# EAGLE design ESP32_radio_rev1.0 (EAGLE 6.6.0)
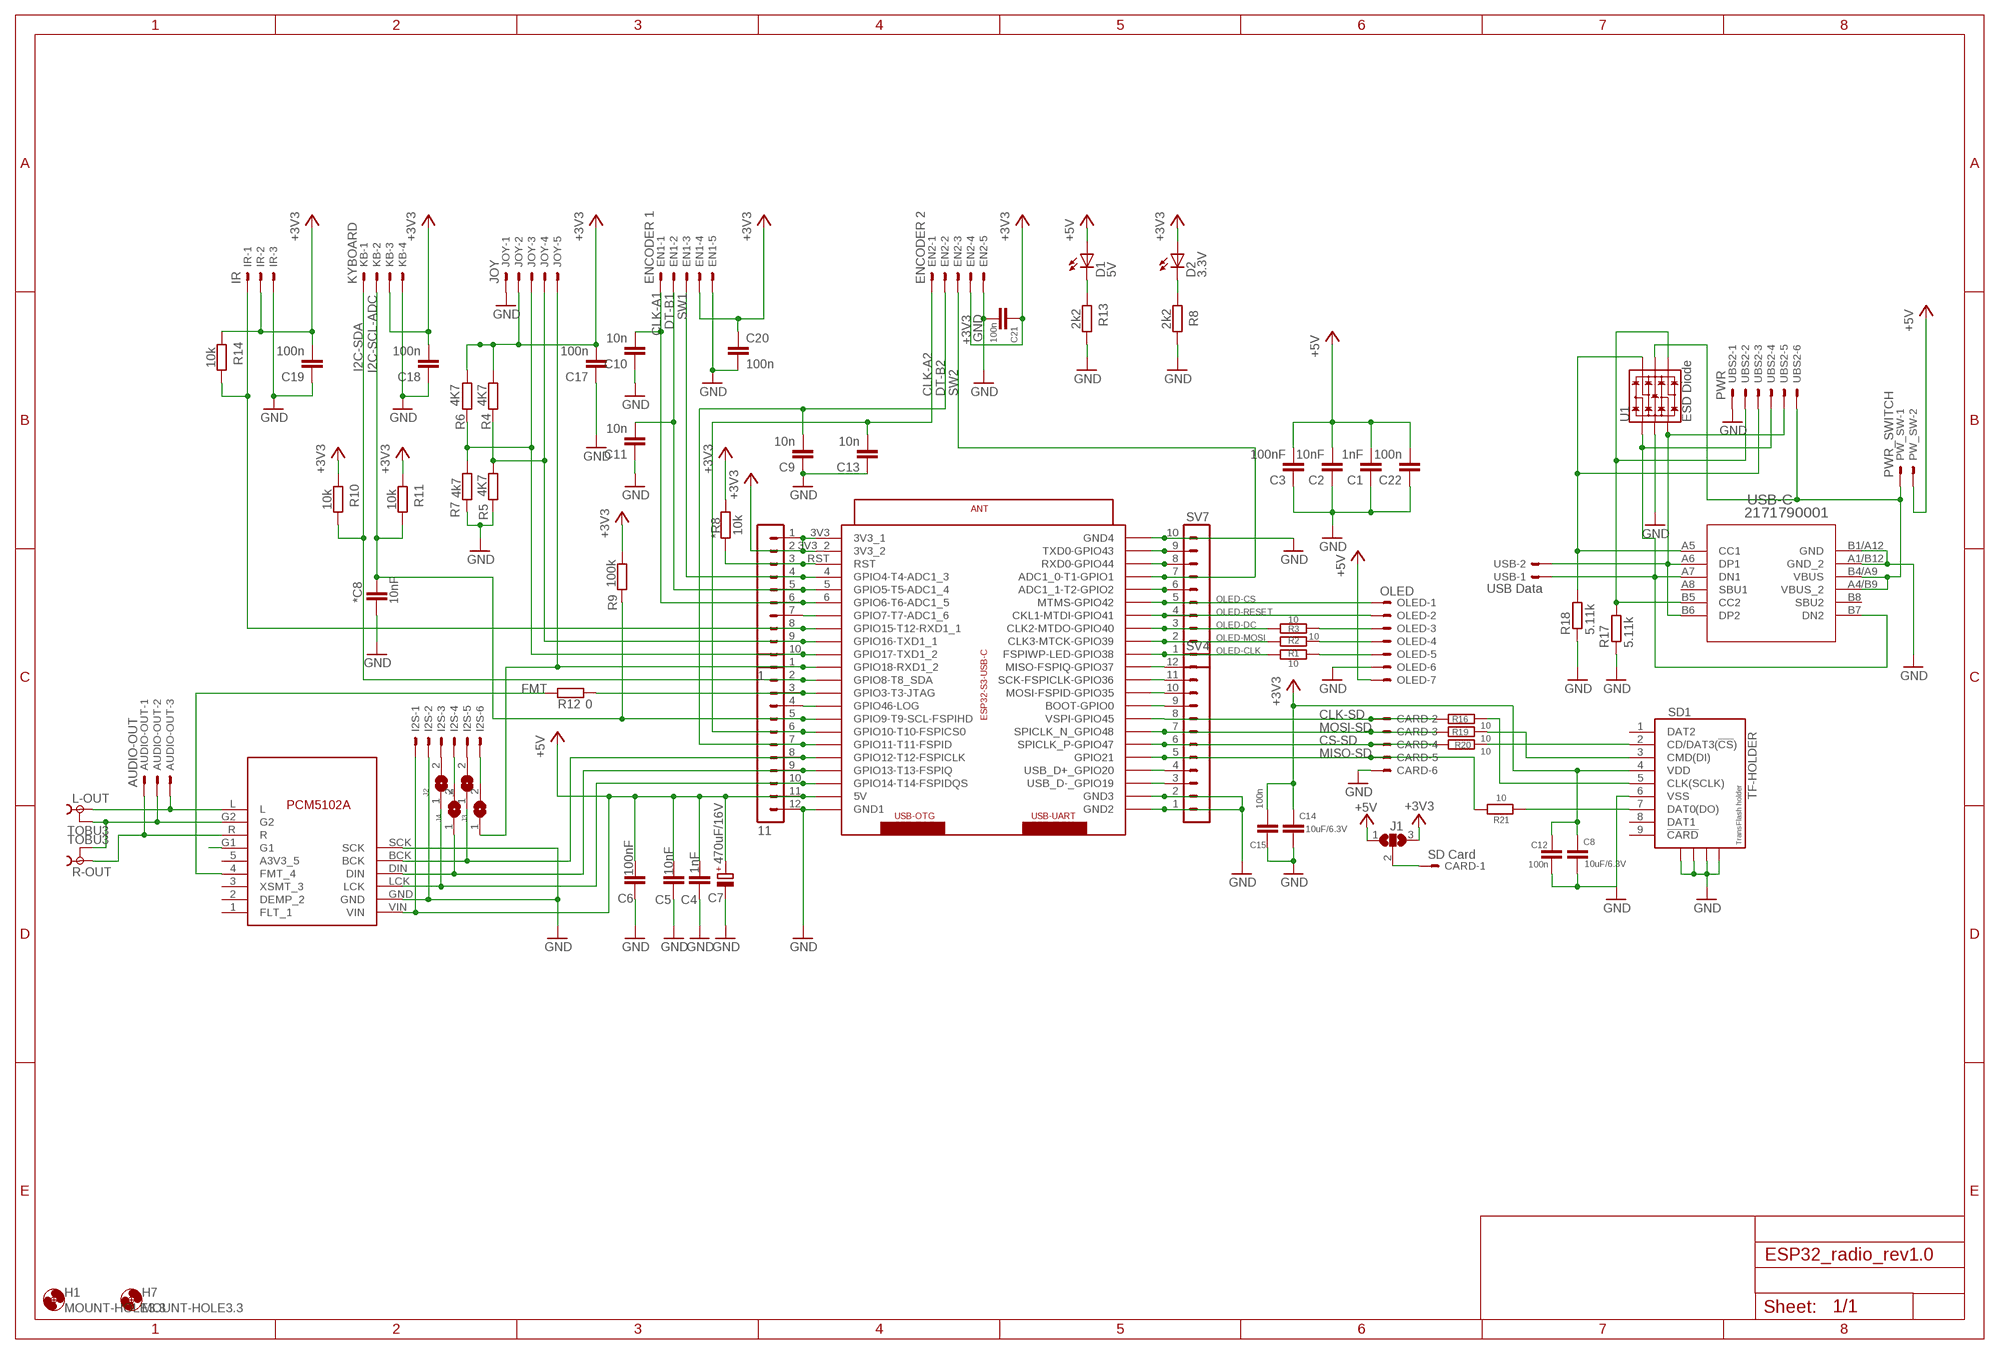
[diagram p0: schematic, sheet 1]

## Parts
1  MA10-1  [MA10-1]
11  MA12-1  [MA12-1]
*C8  10nF  C-EUC0603  [C0603]
*R8  10k  R-EU_R0603  [R0603]
AUDIO-OUT  AUDIO-OUT  JST-XH-03-PIN-LONG-PAD  [JST-XH-03-PACKAGE-LONG-PAD]
C1  1nF  C-EUC0603  [C0603]
C2  10nF  C-EUC0603  [C0603]
C3  100nF  C-EUC0603  [C0603]
C4  1nF  C-EUC0603  [C0603]
C5  10nF  C-EUC0603  [C0603]
C6  100nF  C-EUC0603  [C0603]
C7  470uF/16V  CPOL-EU150CLZ-1010  [150CLZ-1010]
C8  10uF/6.3V  C-EUC1210  [C1210]
C9  10n  C-EUC0603  [C0603]
C10  10n  C-EUC0603  [C0603]
C11  10n  C-EUC0603  [C0603]
C12  100n  C-EUC0603  [C0603]
C13  10n  C-EUC0603  [C0603]
C14  10uF/6.3V  C-EUC1210  [C1210]
C15  100n  C-EUC0603  [C0603]
C17  100n  C-EUC0603  [C0603]
C18  100n  C-EUC0603  [C0603]
C19  100n  C-EUC0603  [C0603]
C20  100n  C-EUC0603  [C0603]
C21  100n  C-EUC0603  [C0603]
C22  100n  C-EUC0603  [C0603]
CARD  SD Card  JST-XH-06-PIN-LONG-PAD  [JST-XH-06-PACKAGE-LONG-PAD]
D1  5V  LEDCHIP-LED0805  [CHIP-LED0805]
D2  3.3V  LEDCHIP-LED0805  [CHIP-LED0805]
EN1  ENCODER 1  JST-XH-05-PIN-LONG-PAD  [JST-XH-05-PACKAGE-LONG-PAD]
EN2  ENCODER 2  JST-XH-05-PIN-LONG-PAD  [JST-XH-05-PACKAGE-LONG-PAD]
H1  MOUNT-HOLE3.3  [3,3]
H7  MOUNT-HOLE3.3  [3,3]
I2S  JST-XH-06-PIN-LONG-PAD  [JST-XH-06-PACKAGE-LONG-PAD]
IR  IR  JST-XH-03-PIN-LONG-PAD  [JST-XH-03-PACKAGE-LONG-PAD]
J1  SJ2W  [SJ_2]
J2  SJ  [SJ]
J3  SJ  [SJ]
J4  SJ  [SJ]
J5  SJ  [SJ]
JOY  JOY  JST-XH-05-PIN-LONG-PAD  [JST-XH-05-PACKAGE-LONG-PAD]
KB  KYBOARD  JST-XH-04-PIN-LONG-PAD  [JST-XH-04-PACKAGE-LONG-PAD]
L-OUT  TOBU3  [TOBU3]
M2  I2S_PCM_51XX_SOUNDCARD  [I2S_PCM_5100_SOUNDCARD]
OLED  OLED  JST-XH-07-PIN-LONG-PAD  [JST-XH-07-PACKAGE-LONG-PAD]
PW_SW  PWR_SWITCH  JST-XH-02-PIN-LONG-PAD  [JST-XH-02-PACKAGE-LONG-PAD]
R1  10  R-EU_R0603  [R0603]
R2  10  R-EU_R0603  [R0603]
R3  10  R-EU_R0603  [R0603]
R4  4K7  R-EU_R0603  [R0603]
R5  4K7  R-EU_R0603  [R0603]
R6  4K7  R-EU_R0603  [R0603]
R7  4k7  R-EU_R0603  [R0603]
R8  2k2  R-EU_R0603  [R0603]
R9  100k  R-EU_R0603  [R0603]
R10  10k  R-EU_R0603  [R0603]
R11  10k  R-EU_R0603  [R0603]
R12  0  R-EU_R0603  [R0603]
R13  2k2  R-EU_R0603  [R0603]
R14  10k  R-EU_R0603  [R0603]
R16  10  R-EU_R0603  [R0603]
R17  5.11k  R-EU_R0603  [R0603]
R18  5.11k  R-EU_R0603  [R0603]
R19  10  R-EU_R0603  [R0603]
R20  10  R-EU_R0603  [R0603]
R21  10  R-EU_R0603  [R0603]
R-OUT  TOBU3  [TOBU3]
SD1  TF-HOLDER  [TF-PULL]
SV4  MA12-1  [MA12-1]
SV7  MA10-1  [MA10-1]
U1  ESD Diode  TVS_DIODE_ARRAY_DT1042-04SO-7  [SOT-23-6]
U$1  ESP32-S3-USBC  [ESP32-S3-USBC]
UBS2  PWR  JST-XH-06-PIN-LONG-PAD  [JST-XH-06-PACKAGE-LONG-PAD]
USB  USB Data  JST-XH-02-PIN-LONG-PAD  [JST-XH-02-PACKAGE-LONG-PAD]
USB-C  2171790001  [2171790001_MOL]

## Nets
5V_USB: PW_SW.1 U1.5(VCC) UBS2.6 USB-C.A4/B9(VBUS_2) USB-C.B4/A9(VBUS)
+3V3: 1.1 1.2 *R8.1 C8.1 C12.2 C14.1 C15.2 C17.2 C18.2 C19.2 C20.1 C21.1 D2.A EN1.4 EN2.4 IR.2 J1.3 JOY.2 KB.3 R4.2 R6.2 R9.2 R10.2 R11.2 R14.2 SD1.4(VDD) U$1.3V3(3V3_1) U$1.3V3_2
+5V: 11.11 C1.2 C2.2 C3.2 C4.2 C5.2 C6.2 C7.+ C22.2 D1.A I2S.1 J1.1 M2.VIN OLED.7 PW_SW.2 U$1.5V
ANALOGGND: AUDIO-OUT.2 L-OUT.2 L-OUT.2@1 L-OUT.2@2 M2.G2 R-OUT.2 R-OUT.2@1 R-OUT.2@2
CLK-A1: 1.6 C10.2 EN1.1 U$1.6(GPIO6-T6-ADC1_5)
CLK-A2: 11.6 C13.2 EN2.1 U$1.10(GPIO10-T10-FSPICS0)
CLK-SD: CARD.2 R16.1 SV4.8 U$1.45(VSPI-GPIO45)
CS-SD: CARD.4 R20.1 SV4.6 U$1.47(SPICLK_P-GPIO47)
DT-B1: 1.5 C11.2 EN1.2 U$1.5(GPIO5-T5-ADC1_4)
DT-B2: 11.7 C9.2 EN2.2 U$1.11(GPIO11-T11-FSPID)
FMT: M2.4(FMT_4) R12.2
FMT1: 11.4 U$1.46(GPIO46-LOG)
GND: 11.12 *C8.2 C1.1 C2.1 C3.1 C4.1 C5.1 C6.1 C7.- C8.2 C9.1 C10.1 C11.1 C12.1 C13.1 C14.2 C15.1 C17.1 C18.1 C19.1 C20.2 C21.2 C22.1 CARD.6 EN1.5 EN2.5 I2S.2 IR.3 JOY.1 KB.4 M2.GND M2.SCK OLED.6 R5.1 R7.1 R8.1 R13.1 R17.1 R18.1 SD1.6(VSS) SD1.S1 SD1.S2 SD1.S3 SD1.S4 SV4.1 SV4.2 SV7.10 U1.2(VSS) U$1.GND1 U$1.GND2 U$1.GND3 U$1.GND4 UBS2.1 USB-C.A1/B12(GND_2) USB-C.B1/A12(GND)
I2C-SCL-ADC: 11.5 *C8.1 KB.2 R9.1 R11.1 U$1.9(GPIO9-T9-SCL-FSPIHD)
I2C-SDA: 11.2 KB.1 R10.1 U$1.8(GPIO8-T8_SDA)
MISO-SD: CARD.5 R21.1 SV4.5 U$1.21(GPIO21)
MOSI-SD: CARD.3 R19.1 SV4.7 U$1.48(SPICLK_N_GPIO48)
N$1: AUDIO-OUT.1 M2.R R-OUT.1
N$2: M2.G1
N$3: AUDIO-OUT.3 L-OUT.1 M2.L
N$4: OLED.5 R1.2
N$5: OLED.4 R2.2
N$6: OLED.3 R3.2
N$7: R21.2 SD1.7(DAT0(DO))
N$8: 1.10 JOY.3 R6.1 R7.2 U$1.17(GPIO17-TXD1_2)
N$9: 11.1 J3.1 JOY.5 U$1.18(GPIO18-RXD1_2)
N$10: 11.10 J2.1 M2.LCK U$1.14(GPIO14-T14-FSPIDQS)
N$11: 1.3 *R8.2 U$1.RST
N$12: R20.2 SD1.2(CD/DAT3(!CS!))
N$13: 1.9 JOY.4 R4.1 R5.2 U$1.16(GPIO16-TXD1_1)
N$14: 11.9 J4.1 M2.DIN U$1.13(GPIO13-T13-FSPIQ)
N$15: 11.8 J5.1 M2.BCK U$1.12(GPIO12-T12-FSPICLK)
N$16: 1.7 U$1.7(GPIO7-T7-ADC1_6)
N$17: SV7.6 U$1.2(ADC1_1-T2-GPIO2)
N$18: 1.8 IR.1 R14.1 U$1.15(GPIO15-T12-RXD1_1)
N$19: D2.C R8.2
N$20: SV7.8 U$1.44(RXD0-GPIO44)
N$21: SV7.9 U$1.43(TXD0-GPIO43)
N$22: SV4.3 U$1.19(USB_D-_GPIO19)
N$23: SV4.4 U$1.20(USB_D+_GPIO20)
N$24: SV4.9 U$1.0(BOOT-GPIO0)
N$25: SV4.10 U$1.35(MOSI-FSPID-GPIO35)
N$26: SV4.11 U$1.36(SCK-FSPICLK-GPIO36)
N$27: SV4.12 U$1.37(MISO-FSPIQ-GPIO37)
N$28: 11.3 R12.1 U$1.3(GPIO3-T3-JTAG)
N$30: D1.C R13.2
N$31: CARD.1 J1.2
N$32: R19.2 SD1.3(CMD(DI))
N$33: R16.2 SD1.5(CLK(SCLK))
N$34: U1.3(IO2) UBS2.5 USB-C.A6(DP1) USB-C.B6(DP2) USB.2
N$35: U1.1(IO1) UBS2.4 USB-C.A7(DN1) USB-C.B7(DN2) USB.1
N$36: I2S.3 J2.2
N$37: R17.2 U1.4(IO3) UBS2.2 USB-C.B5(CC2)
N$38: R18.2 U1.6(IO4) UBS2.3 USB-C.A5(CC1)
N$39: I2S.6 J3.2
N$40: I2S.5 J5.2
N$41: I2S.4 J4.2
OLED-CLK: R1.1 SV7.1 U$1.38(FSPIWP-LED-GPIO38)
OLED-CS: OLED.1 SV7.5 U$1.42(MTMS-GPIO42)
OLED-DC: R3.1 SV7.3 U$1.40(CLK2-MTDO-GPIO40)
OLED-MOSI: R2.1 SV7.2 U$1.39(CLK3-MTCK-GPIO39)
OLED-RESET: OLED.2 SV7.4 U$1.41(CKL1-MTDI-GPIO41)
SW1: 1.4 EN1.3 U$1.4(GPIO4-T4-ADC1_3)
SW2: EN2.3 SV7.7 U$1.1(ADC1_0-T1-GPIO1)
Unconnected: M2.1(FLT_1) M2.2(DEMP_2) M2.3(XSMT_3) M2.5(A3V3_5) SD1.1(DAT2) SD1.8(DAT1) SD1.9(!CARD) USB-C.A8(SBU1) USB-C.B8(SBU2)

## Library data of the parts
1 = con-goldpins:MA10-1: PIN HEADER; OC_FARNELL: unknown; OC_NEWARK: unknown
11 SV4 = con-goldpins:MA12-1: PIN HEADER; OC_FARNELL: unknown; OC_NEWARK: unknown
*C8 C1-C6 C8-C15 C17-C22 = rcl:C-EU: CAPACITOR, European symbol
*R8 R1-R14 R16-R21 = rcl:R-EU_: RESISTOR, European symbol
AUDIO-OUT IR = JST XH Connectors v1-0:JST-XH-03-PIN: JST XH Connector 2 Pin Wire to board connector. Pitch: 2,54 mm, (0.100") Number of pins: 3 Created by Rembrandt Electronics www.rembrandtelectronics.com
C7 = rcl:CPOL-EU: POLARIZED CAPACITOR, European symbol
CARD I2S UBS2 = JST XH Connectors v1-0:JST-XH-06-PIN: JST XH Connector 2 Pin Wire to board connector. Pitch: 2,54 mm, (0.100") Number of pins: 6 Created by Rembrandt Electronics www.rembrandtelectronics.com
D1 D2 = led:LED: LED OSRAM: - CHIPLED LG R971, LG N971, LY N971, LG Q971, LY Q971, LO R971, LY R971 LH N974, LH R974 LS Q976, LO Q976, LY Q976 LO Q996 - Hyper CHIPLED LW Q18S LB Q993, LB Q99A, LB R99A - SideLED LS A670, LO A670, LY A670, LG A670, LP A670 LB A673, LV A673, LT A673, LW A673 LH A674 LY A675 LS A676, LA A676, LO A676, LY A676, LW A676 LS A679, LY A679, LG A679 - Hyper Micro SIDELED® LS Y876, LA Y876, LO Y876, LY Y876 LT Y87S - SmartLED LW L88C, LW L88S LB L89C, LB L89S, LG L890 LS L89K, LO L89K, LY L89K LS L896, LA L896, LO L896, LY L896 - TOPLED LS T670, LO T670, LY T670, LG T670, LP T670 LSG T670, LSP T670, LSY T670, LOP T670, LYG T670 LG T671, LOG T671, LSG T671 LB T673, LV T673, LT T673, LW T673 LH T674 LS T676, LA T676, LO T676, LY T676, LB T676, LH T676, LSB T676, LW T676 LB T67C, LV T67C, LT T67C, LS T67K, LO T67K, LY T67K, LW E67C LS E67B, LA E67B, LO E67B, LY E67B, LB E67C, LV E67C, LT E67C LW T67C LS T679, LY T679, LG T679 LS T770, LO T770, LY T770, LG T770, LP T770 LB T773, LV T773, LT T773, LW T773 LH T774 LS E675, LA E675, LY E675, LS T675 LS T776, LA T776, LO T776, LY T776, LB T776 LHGB T686 LT T68C, LB T68C - Hyper Mini TOPLED® LB M676 - Mini TOPLED Santana® LG M470 LS M47K, LO M47K, LY M47K Source: http://www.osram.convergy.de LUXEON: - LUMILED® LXK2-PW12-R00, LXK2-PW12-S00, LXK2-PW14-U00, LXK2-PW14-V00 LXK2-PM12-R00, LXK2-PM12-S00, LXK2-PM14-U00 LXK2-PE12-Q00, LXK2-PE12-R00, LXK2-PE12-S00, LXK2-PE14-T00, LXK2-PE14-U00 LXK2-PB12-K00, LXK2-PB12-L00, LXK2-PB12-M00, LXK2-PB14-N00, LXK2-PB14-P00, LXK2-PB14-Q00 LXK2-PR12-L00, LXK2-PR12-M00, LXK2-PR14-Q00, LXK2-PR14-R00 LXK2-PD12-Q00, LXK2-PD12-R00, LXK2-PD12-S00 LXK2-PH12-R00, LXK2-PH12-S00 LXK2-PL12-P00, LXK2-PL12-Q00, LXK2-PL12-R00 Source: www.luxeon.com KINGBRIGHT: KA-3528ASYC Source: www.kingbright.com
EN1 EN2 JOY = JST XH Connectors v1-0:JST-XH-05-PIN: JST XH Connector 2 Pin Wire to board connector. Pitch: 2,54 mm, (0.100") Number of pins: 5 Created by Rembrandt Electronics www.rembrandtelectronics.com
H1 H7 = holes:MOUNT-HOLE: MOUNTING HOLE with drill center marker
J1 = jumper:SJ2W: SMD solder JUMPER
J2-J5 = jumper:SJ: SMD solder JUMPER
KB = JST XH Connectors v1-0:JST-XH-04-PIN: JST XH Connector 2 Pin Wire to board connector. Pitch: 2,54 mm, (0.100") Number of pins: 4 Created by Rembrandt Electronics www.rembrandtelectronics.com
L-OUT R-OUT = con-hirschmann:TOBU3: Female Cinch CONNECTOR ( RCA Jack ); MF: FARNELL; MPN: TOBU 3; OC_FARNELL: 592791; OC_NEWARK: 06WX5914
M2 = PCM5102A:I2S_PCM_51XX_SOUNDCARD
OLED = JST XH Connectors v1-0:JST-XH-07-PIN: JST XH Connector 2 Pin Wire to board connector. Pitch: 2,54 mm, (0.100") Number of pins: 7 Created by Rembrandt Electronics www.rembrandtelectronics.com
PW_SW USB = JST XH Connectors v1-0:JST-XH-02-PIN: JST XH Connector 2 Pin Wire to board connector. Pitch: 2,54 mm, (0.100") Number of pins: 2 Created by Rembrandt Electronics www.rembrandtelectronics.com
SD1 = sd-mmc:TF-HOLDER: TF / Micro SD socket is PUSH-PUSH type, the card can be pushed into and auto locked and pushed out by simply press the card. Surface Mounting type.
SV7 = con-lstb:MA10-1: PIN HEADER; OC_FARNELL: unknown; OC_NEWARK: unknown
U1 = SparkFun-DiscreteSemi:TVS_DIODE_ARRAY; PROD_ID: IC-13538
U$1 = ESP32:ESP32-S3-USBC: ESP32 S3 WROOM-1; WROOM-1: ESP32
USB-C = USB-C_2:2171790001; COPYRIGHT: Copyright (C) 2025 GRo; MANUFACTURER_PART_NUMBER: USB4105-GF-A-120; MFR_NAME: GFT

## Net classes
0 default: clearance 0.205 mm

## Board
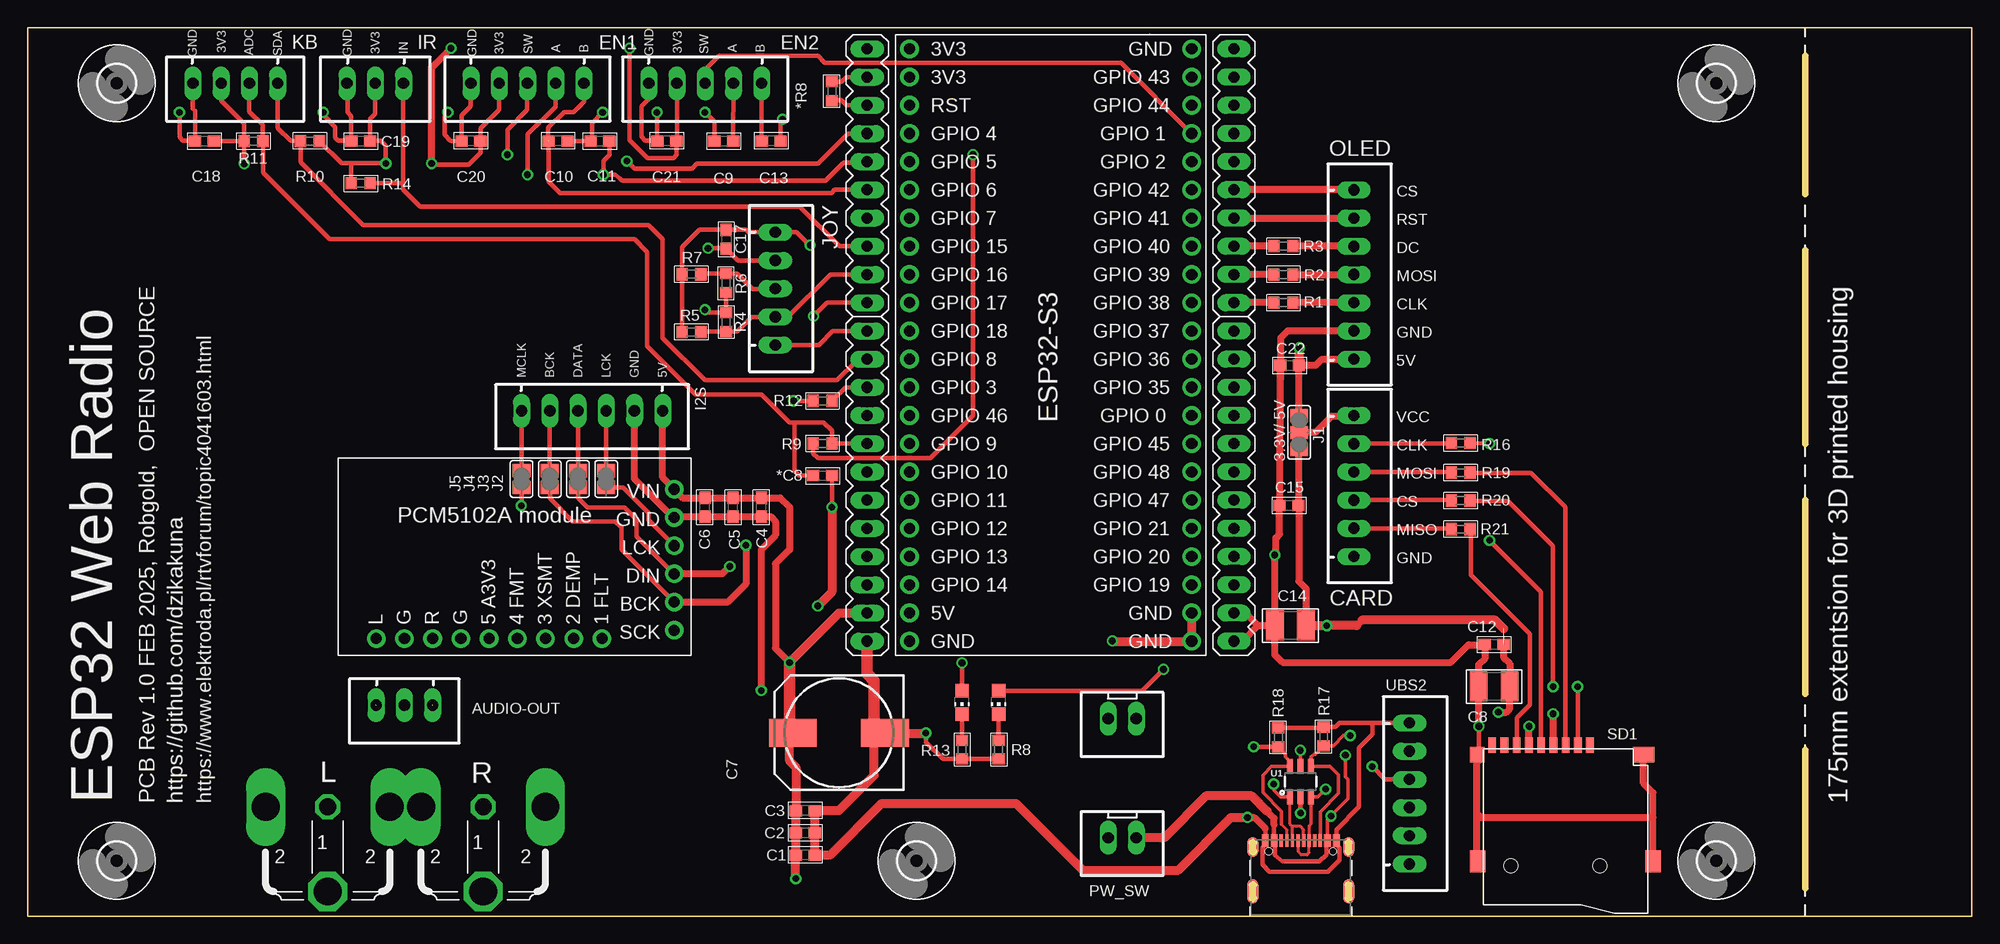
[diagram p1: board, top side]
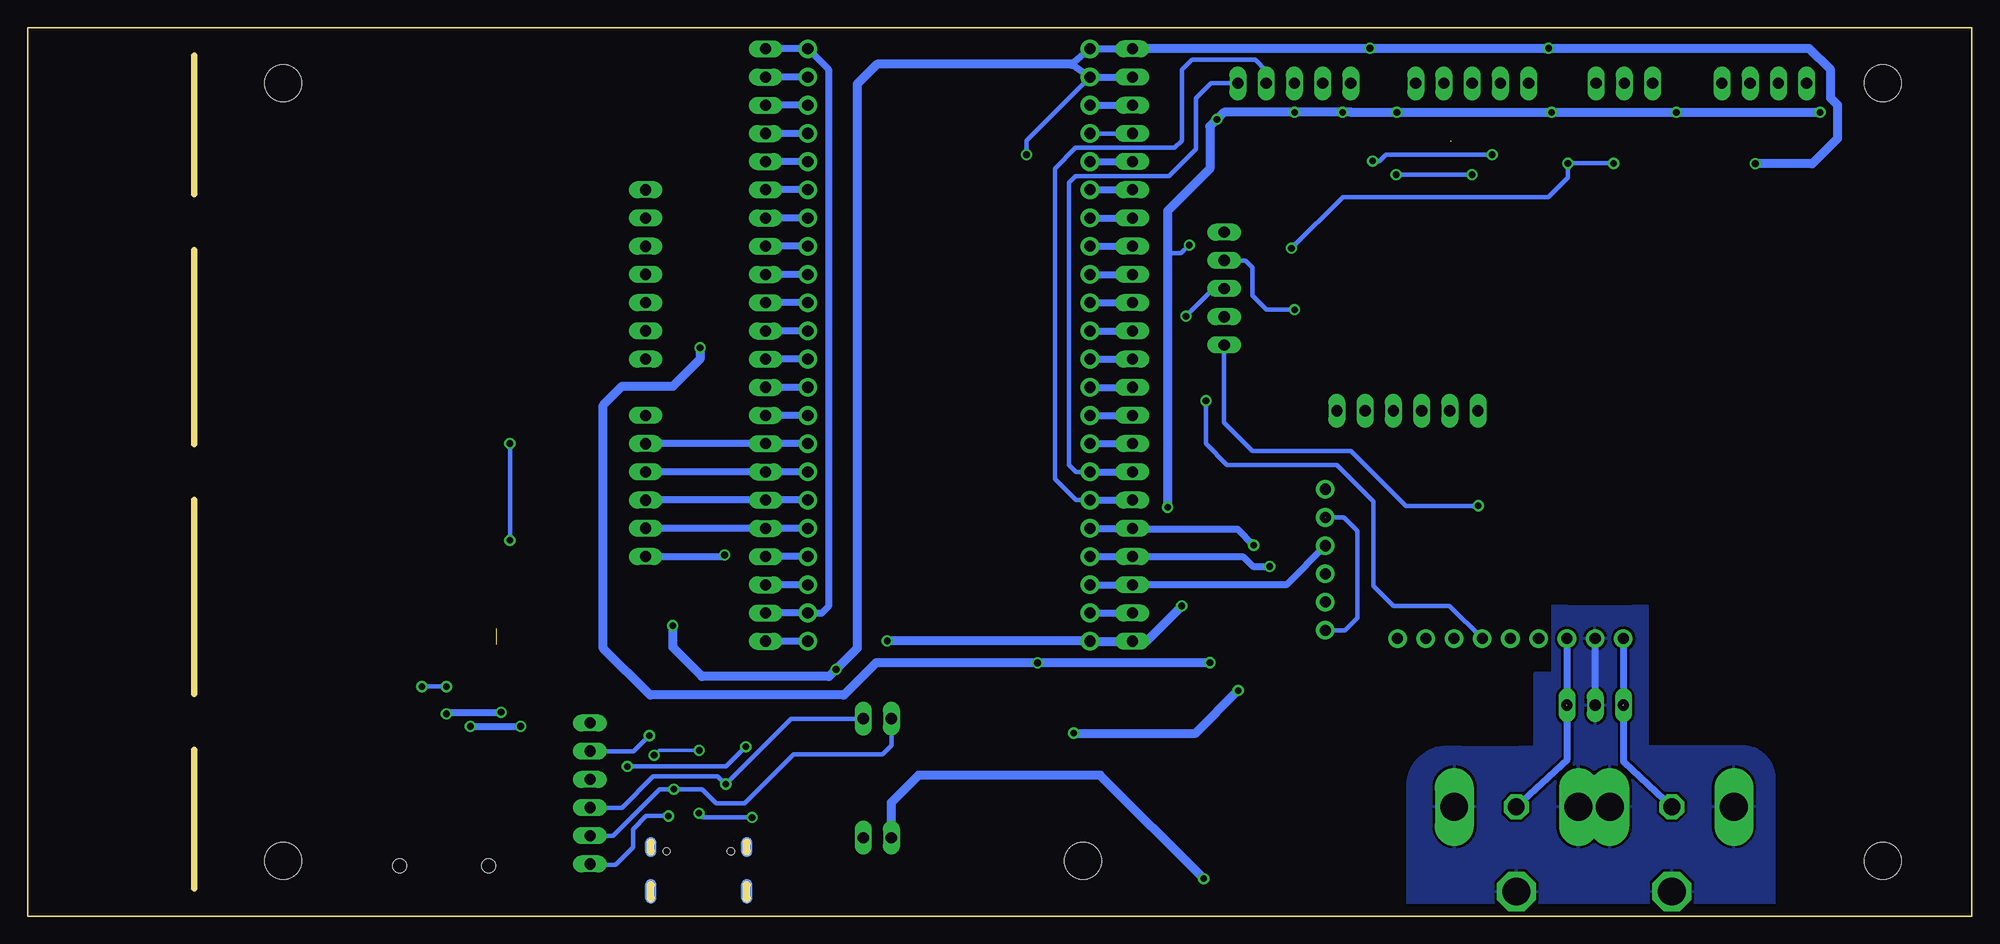
[diagram p2: board, bottom side, seen from below]

Size 175 x 80 mm. Coordinates in mm from the lower left corner, seen from the top.
Outline: 0,0 175,0 175,80 0,80 0,0
Copper layers (1*16): Top 0.035mm / dielectric 1.5mm / Bottom 0.035mm
Design rules "default": minimum track width 10mil, minimum drill 24mil, track to track 8mil, track to pad 8mil, pad to pad 8mil, via to via 8mil, smd to smd 8mil, copper to edge 40mil, drill to drill 8mil, minimum pad ring 10mil, minimum via ring 8mil, stop-mask expansion 4mil, vias tented up to drill 0mil, thermal gap 10mil
tKeepout: area 115.6,76.2 to 135.9,80
bKeepout: area 115.6,76.2 to 135.9,80
Milling: 4 lines

### Footprints (pad centres in the part's own frame; a part is rotated, then mirrored left to right if it is on the bottom)
MA10-1 = drill 1 long: 1 -11.43,0; 2 -8.89,0; 3 -6.35,0; 4 -3.81,0; 5 -1.27,0; 6 1.27,0; 7 3.81,0; 8 6.35,0; 9 8.89,0; 10 11.43,0
MA12-1 = drill 1 long: 1 -13.97,0; 2 -11.43,0; 3 -8.89,0; 4 -6.35,0; 5 -3.81,0; 6 -1.27,0; 7 1.27,0; 8 3.81,0; 9 6.35,0; 10 8.89,0; 11 11.43,0; 12 13.97,0
C0603 = smd 1.1 x 1: 1 -0.85,0; 2 0.85,0
R0603 = smd 1 x 1.1: 1 -0.85,0; 2 0.85,0
JST-XH-03-PACKAGE-LONG-PAD = drill 1.016 long: 1 -2.54,0; 2 0,0; 3 2.54,0
150CLZ-1010 = smd 4.3 x 2.5: + 4.15,0; - -4.15,0
C1210 = smd 1.6 x 2.7: 1 -1.4,0; 2 1.4,0
JST-XH-06-PACKAGE-LONG-PAD = drill 1.016 long: 1 -6.35,0; 2 -3.81,0; 3 -1.27,0; 4 1.27,0; 5 3.81,0; 6 6.35,0
CHIP-LED0805 = smd 1.2 x 1.2: A 0,-1.05; C 0,1.05
JST-XH-05-PACKAGE-LONG-PAD = drill 1.016 long: 1 -5.08,0; 2 -2.54,0; 3 0,0; 4 2.54,0; 5 5.08,0
3,3 = hole 3.3: 0,0
SJ_2 = smd 1.168 x 1.6: 1 -1.524,0; 2 0,0; 3 1.524,0
SJ = smd 1.168 x 1.6: 1 -0.762,0; 2 0.762,0
JST-XH-04-PACKAGE-LONG-PAD = drill 1.016 long: 1 -3.81,0; 2 -1.27,0; 3 1.27,0; 4 3.81,0
TOBU3 = drill 1.5 octagon: 1 0,-2.54 | drill 2.5 pad 3.2 long: 2 5.588,-2.54; 2@1 -5.588,-2.54 | drill 2.5 octagon: 2@2 0,5.08
I2S_PCM_5100_SOUNDCARD = drill 1 pad 1.676: 1 1.5,8; 2 1.5,10.54; 3 1.5,13.08; 4 1.5,15.62; 5 1.5,18.16; BCK 4.79,1.5; DIN 7.33,1.5; G1 1.5,20.7; G2 1.5,25.78; GND 12.41,1.5; L 1.5,28.32; LCK 9.87,1.5; R 1.5,23.24; SCK 2.25,1.5; VIN 14.95,1.5
JST-XH-07-PACKAGE-LONG-PAD = drill 1.016 long: 1 -7.62,0; 2 -5.08,0; 3 -2.54,0; 4 0,0; 5 2.54,0; 6 5.08,0; 7 7.62,0
JST-XH-02-PACKAGE-LONG-PAD = drill 1.016 long: 1 -1.27,0; 2 1.27,0
TF-PULL = smd 0.7 x 1.4: 1 -2.2,-7.62; 2 -1.1,-7.62; 3 0,-7.62; 4 1.1,-7.62; 5 2.2,-7.62; 6 3.3,-7.62; 7 4.4,-7.62; 8 5.5,-7.62; 9 6.6,-7.62 | smd 1.4 x 2: S1 -7.9,2.85; S2 7.9,2.85 | smd 1.28 x 1.4: S3 7.96,-6.75 | smd 1.95 x 1.4: S4 -7.025,-6.75 | hole 1.25: -3.1,3.25; 4.9,3.25
SOT-23-6 = smd 0.55 x 1.35: 1 -0.95,-1.375; 2 0,-1.375; 3 0.95,-1.375; 4 0.95,1.375; 5 0,1.375; 6 -0.95,1.375
ESP32-S3-USBC = drill 1 pad 1.676: 0 12.7,-5.08; 1 12.7,20.32; 2 12.7,17.78; 3 -12.7,-2.54; 3V3 -12.7,27.94; 3V3_2 -12.7,25.4; 4 -12.7,20.32; 5 -12.7,17.78; 5V -12.7,-22.86; 6 -12.7,15.24; 7 -12.7,12.7; 8 -12.7,0; 9 -12.7,-7.62; 10 -12.7,-10.16; 11 -12.7,-12.7; 12 -12.7,-15.24; 13 -12.7,-17.78; 14 -12.7,-20.32; 15 -12.7,10.16; 16 -12.7,7.62; 17 -12.7,5.08; 18 -12.7,2.54; 19 12.7,-20.32; 20 12.7,-17.78; 21 12.7,-15.24; 35 12.7,-2.54; 36 12.7,0; 37 12.7,2.54; 38 12.7,5.08; 39 12.7,7.62; 40 12.7,10.16; 41 12.7,12.7; 42 12.7,15.24; 43 12.7,25.4; 44 12.7,22.86; 45 12.7,-7.62; 46 -12.7,-5.08; 47 12.7,-12.7; 48 12.7,-10.16; GND1 -12.7,-25.4; GND2 12.7,-25.4; GND3 12.7,-22.86; GND4 12.7,27.94; RST -12.7,22.86
2171790001_MOL = smd 0.991 x 1.803 bottom: 1 -4.32,2.728; 5 4.32,2.728 | smd 0.991 x 2.21 bottom: 2 -4.32,-1.272; 3 4.32,-1.272 | smd 0.991 x 1.803: 4 4.32,2.728; 15 -4.32,2.728; 16 4.32,2.728 | smd 0.991 x 2.21: 13 -4.32,-1.272; 14 4.32,-1.272 | smd 0.61 x 1.143: A1/B12 -3.2,3.303; A4/B9 -2.4,3.303; B1/A12 3.2,3.303; B4/A9 2.4,3.303 | smd 0.305 x 1.143: A5 -1.25,3.303; A6 -0.25,3.303; A7 0.25,3.303; A8 1.25,3.303; B5 1.75,3.303; B6 0.75,3.303; B7 -0.75,3.303; B8 -1.75,3.303 | hole 0.6: -4.32,-1.876; -4.32,-0.686; -4.32,3.124; -4.32,2.337; 4.32,3.124; 4.32,2.337; 4.32,-0.686; 4.32,-1.88 | hole 0.65: -2.89,2.337; 2.89,2.337

### Placement (x,y rotation side)
1  75.56,66.67 270 top
11  75.56,38.73 270 top
*C8  71.55,39.67 0 top
*R8  72.39,74.3 270 top
AUDIO-OUT  33.9,19 180 top
C1  70,5.5 180 top
C2  70,7.5 180 top
C3  70,9.5 180 top
C4  66.04,36.83 90 top
C5  63.5,36.83 90 top
C6  60.96,36.83 90 top
C7  73.03,16.51 180 top
C8  132,20.68 180 top
C9  62.66,69.8 0 top
C10  47.74,69.8 180 top
C11  51.51,69.8 0 top
C12  132,24.47 0 top
C13  66.92,69.8 180 top
C14  113.67,26.16 180 top
C15  113.54,37 0 top
C17  62.87,60.96 270 top
C18  15.9,69.8 0 top
C19  29.98,69.8 0 top
C20  39.9,69.8 180 top
C21  57.53,69.8 180 top
C22  113.59,49.61 0 top
CARD  119.38,38.73 270 top
D1  84.1,19.25 180 top
D2  87.4,19.25 180 top
EN1  44.98,75 180 top
EN2  60.98,75 180 top
H1  8,75 0 top
H2  MOUNT-HOLE3.3  [3,3]  152,75 0 top
H3  MOUNT-HOLE3.3  [3,3]  152,5 0 top
H7  8,5 0 top
H8  MOUNT-HOLE3.3  [3,3]  80,5 0 top
I2S  50.8,45.5 180 top
IR  31.28,75 180 top
J1  114.45,43.56 270 top
J2  52.07,39.37 90 top
J3  44.45,39.37 90 top
J4  49.53,39.37 90 top
J5  46.99,39.37 90 top
JOY  67.29,56.51 270 top
KB  18.68,75 180 top
L-OUT  27,7.3 180 top
M2  59.69,23.5 90 top
OLED  119.38,57.78 270 top
PW_SW  98.53,7.06 180 top
R1  113.03,55.24 0 top
R2  113.03,57.78 0 top
R3  113.03,60.33 0 top
R4  62.87,53.49 90 top
R5  59.74,52.6 0 top
R6  62.87,57 270 top
R7  59.74,57.8 0 top
R8  87.4,15 90 top
R9  71.55,42.57 180 top
R10  25.4,69.8 0 top
R11  20.32,69.8 180 top
R12  71.55,46.41 180 top
R13  84.1,15 90 top
R14  29.98,66 180 top
R16  129,42.6 0 top
R17  116.66,16.18 270 top
R18  112.57,16.1 270 top
R19  129,39.93 0 top
R20  129,37.41 0 top
R21  129,34.85 0 top
R-OUT  41,7.3 180 top
SD1  138.43,7.8 180 top
SV4  108.58,38.73 90 top
SV7  108.58,66.67 90 top
U1  114.58,12.12 0 top
U$1  92.08,50.16 0 top
UBS2  124.38,11.05 270 top
USB  98.53,17.78 180 top
USB-C  114.6,3.5 0 top

### Tracks (layer width: path | path; a pad name or v marks a point on that pad's centre or on a via)
5V_USB  (via drill 0.6)
  Top 0.305: U1.5 114.55,13.52 v114.55,14.94 | USB-C.B4/A9 117,8.69 v117.32,9.02 118.85,10.55 118.85,12.32 118.62,12.55 v118.62,14.49
  Top 0.406: 112.19,8.23 USB-C.A4/B9 112.29,6.79 112.29,5.46 112.95,4.93 116.28,4.93 116.89,5.54 116.89,6.69 USB-C.B4/A9
  Top 0.61: 112.19,8.23 112.19,8.81 111.56,9.45 111.56,9.46
  Top 0.813: PW_SW.1 102.31,7.06 106.07,10.82 110.2,10.82 111.56,9.46
  Bottom 0.305: v118.62,14.49 118.18,14.94 v114.55,14.94
  Bottom 0.406: UBS2.6 124.33,4.65 122.07,4.65 120.5,6.22 120.5,7.84 119.32,9.02 v117.32,9.02
+3V3  (via drill 0.6, 0.6 pad 0.81)  (1 unrouted)
  Top 0.406: R9.2 70.71,42.58 70.71,41.68 71.12,41.27 81.28,41.27 85.09,45.09 v85.09,68.58 | 1.2 73.71,75.56 73.28,75.13 72.4,75.13 *R8.1 | R6.2 R4.2 61.23,54.34 v60.96,54.61 | JOY.2 63.92,59.05 C17.2 62.83,60.15 v61.24,60.15 | EN1.4 42.42,74.98 42.42,72.64 40.75,70.98 C20.1 40.75,68.77 39.67,67.69 36.45,67.69 v36.35,67.79 | IR.2 31.29,74.99 31.29,72.26 30.83,71.8 C19.2 30.86,69.77 30.94,69.85 31.75,69.85 32.23,69.37 v32.23,67.79 | 31.55,67.79 v32.23,67.79 | R10.2 28.26,67.79 29.21,67.79 | 29.21,67.79 v32.23,67.79 | C18.2 R11.2 | KB.3 17.41,73.44 19.47,71.38 R11.2 | R14.2 29.13,67.71 29.21,67.79 | EN2.4 58.44,69.86 C21.1 58.42,69.76 58.42,68.58 58.12,68.28 55.78,68.28 54.18,69.88 v54.18,78.16 | v19.48,67.76 v19.47,67.77 R11.2 | D2.A 100.31,20.3 v102.23,22.23
  Top 0.61: 120.14,26.67 119.63,26.16 | v36.35,67.79 36.35,76.41 v38.1,78.16 | C12.2 132.85,23.31 133.4,22.76 C8.1 133.4,18.67 133.1,18.36 v132.38,18.36 | SD1.4 137.33,18.19 v137.31,18.21 | C14.1 115.06,29.51 114.43,30.15 114.43,36.96 C15.2 114.45,37.06 J1.3
  Top 0.813: C14.1 v116.94,26.16 119.63,26.16 | 132.85,25.9 132.08,26.67 120.14,26.67
  Bottom 0.406: v61.24,60.15 56.62,64.77 38.1,64.77 36.35,66.52 v36.35,67.79 v32.23,67.79 | v60.96,54.61 63.5,54.61 64.77,55.88 64.77,58.42 65.4,59.05 JOY.2 | v85.09,68.58 85.09,69.85 U$1.3V3_2
  Bottom 0.61: 1.1 U$1.3V3 81.03,76.71 U$1.3V3_2 1.2 | v137.31,18.21 137.16,18.36 v132.38,18.36
  Bottom 0.813: 81.03,76.71 98.55,76.71 100.33,74.93 100.33,24.13 101.6,22.86 v102.23,22.23 102.87,21.59 114.3,21.59 116.94,24.23 v116.94,26.16 | 1.1 75.51,78.16 v54.18,78.16 v38.1,78.16 14.66,78.16 12.7,76.2 12.7,73.66 12.08,73.04 12.08,70.05 14.37,67.76 v19.48,67.76
+5V  (via drill 0.6)
  Top 0.406: 68.56,22.84 v68.58,22.84 | D1.A v84.1,22.81 arc90 v84.1,22.81
  Top 0.61: 68.58,22.86 67.31,24.13 67.31,31.75 68.58,33.02 68.58,36.83 67.73,37.68 C4.2 C5.2 C6.2 58.95,37.68 M2.VIN 57.15,39.48 I2S.1 | OLED.7 116.51,50.16 115.95,49.61 C22.2 114.44,45.1 J1.1
  Top 0.813: 67.59,16.53 C7.+ | 11.11 73.03,27.3 68.58,22.86 v68.58,22.84 | C7.+ 68.58,16.8 | C7.+ 68.58,16.21 68.58,13.97 69.15,13.4 C3.2 C2.2 C1.2 69.14,5.49 v69.14,3.38 | C22.2 114.48,49.65 v114.48,51.18
  Top 1.016: 68.58,16.8 v68.58,22.84
  Bottom 0.406: v84.1,22.81 83.87,22.81 arc-90 83.82,22.86
  Bottom 0.61: U$1.5V 11.11 | v68.58,22.84 68.61,22.81
  Bottom 0.813: 68.61,22.81 v84.1,22.81 98.63,22.81 101.52,19.91 118.97,19.91 123.19,24.13 123.19,46.02 121.49,47.73 116.92,47.73 114.48,50.16 v114.48,51.18 | PW_SW.2 97.26,10.24 94.8,12.7 78.46,12.7 v69.14,3.38
ANALOGGND
  Bottom 0.61: M2.G2 33.91,19.03 | R-OUT.2 35.35,11.47 33.92,12.45 32.55,11.35 L-OUT.2@1
  pour Bottom (isolate 0.254): 17.78,0 17.78,12.4 arc-90 20.62,15.24 29.21,15.24 29.21,27.94 arc5 37.75,27.94 37.75,21.85 39.37,21.85 39.37,15.24 arc4 47.21,15.24 arc-90 50.8,11.65 50.8,0
CLK-A1  (1 unrouted)
  Top 0.406: 75.51,65.46 1.6 72.64,65.41 72.34,65.1 47.93,65.1 46.9,66.14 C10.2 | EN1.1 50.06,73.33 49.12,72.39 48.26,72.39 46.86,70.99 46.86,69.83
  Bottom 0.61: U$1.6 1.6
CLK-A2
  Top 0.406: C13.2 66.07,74.99 EN2.1
  Bottom 0.406: U$1.10 80.64,40.01 81.28,40.64 81.28,66.04 80.67,66.65 72.26,66.65 69.85,69.06 69.85,73.66 68.51,75 EN2.1
  Bottom 0.61: U$1.10 11.6
CLK-SD
  Top 0.406: R16.1 128.1,42.55 CARD.2
  Bottom 0.61: U$1.45 SV4.8 CARD.2
CS-SD
  Top 0.406: R20.1 128.1,37.47 CARD.4
  Bottom 0.61: U$1.47 SV4.6 CARD.4
DT-B1  (via drill 0.6)
  Top 0.406: EN1.2 47.51,72.91 45.01,70.41 45.01,66.8 v44.98,66.78 | 1.5 75.49,67.87 73.46,67.87 71.81,66.22 53.52,66.22 53.29,66.45 52.86,66.78 v51.82,66.78 51.82,68.05 52.36,68.59 C11.2
  Bottom 0.406: v51.82,66.78 v44.98,66.78
  Bottom 0.61: U$1.5 1.5
DT-B2
  Top 0.406: C9.2 EN2.2
  Bottom 0.406: U$1.11 80.64,37.47 82.55,39.37 82.55,67.31 80.67,69.19 71.78,69.19 71.12,69.85 71.12,76.2 70.21,77.11 64.49,77.11 63.52,76.14 EN2.2
  Bottom 0.61: U$1.11 11.7
FMT  (via drill 0.6)
  Top 0.406: v68.94,46.41 R12.2
  Bottom 0.406: M2.4 47.02,27.94 52.07,27.94 53.85,29.72 53.85,37.34 57.15,40.64 67.03,40.64 68.94,42.55 v68.94,46.41
FMT1
  Bottom 0.61: U$1.46 11.4
GND  (via drill 0.6, 0.6 pad 0.81)  (2 unrouted)
  Top 0.406: C10.1 C11.1 50.8,69.94 50.8,71.42 v51.77,72.39 | *C8.2 72.4,36.84 v72.39,36.83 | R5.1 R7.1 58.89,60.24 60.48,61.82 62.85,61.82 C17.1 64.66,61.81 64.87,61.59 JOY.1 69.22,61.59 70.38,60.43 v70.43,60.43 | EN1.5 39.85,74.95 39.85,72.92 39.05,72.12 C20.2 38.15,69.8 38.1,69.85 38.02,69.85 37.52,70.36 37.52,72.39 v37.82,72.39 | IR.3 28.78,74.96 28.78,72.39 29.13,72.04 C19.1 29.08,69.85 27.94,69.85 27.69,70.1 27.69,71.07 26.59,72.16 v26.59,72.39 | KB.4 14.86,72.72 15.05,72.53 C18.1 15,69.85 13.97,69.85 13.66,70.16 v13.66,72.39 | v56.64,72.39 56.64,69.84 C21.2 56.63,69.85 55.58,69.85 55.24,70.18 55.24,72.92 55.9,73.58 EN2.5 | USB-C.A1/B12 111.38,6.78 111.38,6.43 111.12,6.17 111.12,4.67 111.78,4.01 117.04,4.01 118.08,5.05 118.08,6.17 117.8,6.46 USB-C.B1/A12 117.8,7.79 119.85,9.85 119.85,15.18 121.07,16.39 121.07,17.4 | USB-C.A1/B12 111.4,7.9 | R18.1 116.59,16.95 R17.1 116.7,17.07 117.73,17.07 118.06,17.4 121.07,17.4 | U1.2 v114.58,9.27 | 135.13,15.24 SD1.6 135.15,15.22 | 130.81,13.97 130.81,14.03 SD1.S3 | 130.47,13.04 130.47,13.78 SD1.S3 | SD1.S3 130.31,14.53 | 121.07,17.4 UBS2.1 | C13.1 67.77,71.58 v67.94,71.75 | C9.1 61.81,71.54 v60.96,72.39 | R8.1 R13.1 82.37,14.15 80.85,15.67 v80.85,16.48 | v130.63,17.09 130.63,14.53 SD1.S3
  Top 0.61: OLED.6 113.41,52.7 112.78,52.07 112.78,48.35 C22.1 C15.1 112.69,34.41 112.34,34.06 112.34,32.61 v112.27,32.53 C14.2 | C14.2 | SV4.2 109.6,27.3 110.74,26.16 | 110.74,26.16 C14.2 | SV4.1 109.35,24.77 110.74,26.16 | C14.2 112.27,23.55 112.95,22.86 128.12,22.86 129.69,24.43 131.12,24.43 C12.1 131.15,23.18 130.61,22.63 C8.2 130.63,20.65 v130.63,17.09 | v66.04,20.32 66.04,33.02 67.31,34.29 67.31,35.56 66.89,35.98 C4.1 C5.1 C6.1 58.27,35.98 M2.GND 58.08,35.91 54.61,39.37 I2S.2 | 70.85,7.59 C2.1 | 70.83,9.45 C3.1 | 55.88,75.02 EN2.5 | C1.1 70.89,5.65 | v109.8,8.89 110.41,8.89 111.4,7.9 | 130.53,14.37 SD1.S3 | SD1.S1 arc-90 146.3,4.8 146.3,8.89 | 146.3,8.89 146.3,11.12 145.46,11.97 | 145.46,11.97 SD1.S4 | 145.46,11.97 145.44,11.96 | SD1.S2 130.47,4.83 130.47,9.27 | 130.47,9.27 130.47,13.78 | 130.47,9.27 130.85,8.89 146.3,8.89 | SD1.6 135.13,17.07 v135.15,17.09
  Top 0.813: v72.39,36.83 72.39,29.21 v71.12,27.94 | U$1.GND3 U$1.GND2 | U$1.GND2 104.78,24.69 104.8,24.66 | v109.8,8.89 108.33,8.89 103.58,4.14 94.97,4.14 88.95,10.16 76.87,10.16 72.21,5.5 C1.1 C2.1 C3.1 73,9.5 76.2,12.7 76.2,16.51 C7.- 77.17,16.48 v80.85,16.48 | v97.64,24.79 97.66,24.77 U$1.GND2
  Top 1.016: 76.2,16.51 76.2,21.21 75.56,21.84 11.12
  Bottom 0.406: 58.17,35.89 56.52,35.89 55.32,34.7 55.32,26.85 56.42,25.75 M2.SCK | v70.43,60.43 71.17,59.69 72.39,59.69 | v114.58,9.27 114.2,8.89 v109.8,8.89
  Bottom 0.61: SV7.10 U$1.GND4 102.87,76.2 102.87,27.94 103.5,27.3 U$1.GND3 SV4.2 | U$1.GND2 SV4.1 | U$1.GND1 11.12 | CARD.6 112.41,32.38 arc-90 v112.27,32.53 | v135.15,17.09 v130.63,17.09
  Bottom 0.813: 55.9,72.41 55.88,72.39 | 55.88,72.39 v56.64,72.39 v60.96,72.39 67.31,72.39 v67.94,71.75 68.58,71.12 68.58,67.31 72.39,63.5 72.39,59.69 v72.39,36.83 | v71.12,27.94 74.3,24.77 U$1.GND1 79.4,24.79 v97.64,24.79 | 55.88,72.39 v51.77,72.39 v51.74,72.39 v37.82,72.39 v26.59,72.39 v13.66,72.39 | v80.85,16.48 69.88,16.48 v66.04,20.32
I2C-SCL-ADC  (1 unrouted)
  Top 0.406: 72.39,42.58 72.39,43.71 71.65,44.45 68.91,44.45 | 68.91,44.45 68.58,44.45 66.04,46.99 60.1,46.99 55.75,51.33 55.75,59.82 54.61,60.96 27.18,60.96 21.17,66.97 R11.1 21.14,69.83 21.14,71.26 19.95,72.45 KB.2 | *C8.1 69.42,39.67 69.01,40.08 69.01,44.35 68.91,44.45 | R9.1 72.43,42.55 11.5
  Bottom 0.61: U$1.9 11.5
I2C-SDA
  Top 0.406: 11.2 75.39,49.99 74.6,49.99 72.87,48.26 60.96,48.26 57.15,52.07 57.15,60.96 55.88,62.23 30.2,62.23 24.55,67.88 R10.1 23.65,69.81 22.49,70.97 KB.1
  Bottom 0.61: U$1.8 11.2
MISO-SD
  Top 0.406: R21.1 128.07,34.92 CARD.5
  Bottom 0.61: U$1.21 SV4.5 CARD.5
MOSI-SD
  Top 0.406: R19.1 128.07,40.01 CARD.3
  Bottom 0.61: U$1.48 SV4.7 CARD.3
N$1  (1 unrouted)
  Bottom 0.61: M2.R 36.45,19.03 | R-OUT.1 36.42,14.1 36.42,18.98 AUDIO-OUT.1
N$3  (1 unrouted)
  Bottom 0.61: M2.L 31.37,19.03 | L-OUT.1 31.34,13.9 31.34,18.98 AUDIO-OUT.3
N$4
  Top 0.61: OLED.5 R1.2
N$5
  Top 0.61: R2.2 OLED.4
N$6
  Top 0.61: OLED.3 R3.2
N$7
  Top 0.406: R21.2 129.9,34.8 129.9,30.73 135.2,25.43 135.2,19.02 134.03,17.85 SD1.7
N$8  (via drill 0.6)
  Top 0.406: 1.10 71.96,55.24 v70.74,54.03 | JOY.3 67.24,56.46 65.25,56.46 63.87,57.85 R6.1 60.64,57.85 R7.2
  Bottom 0.406: JOY.3 68.25,56.51 v70.74,54.03
  Bottom 0.61: U$1.17 1.10
N$9  (via drill 0.6)
  Top 0.406: 11.1 75.54,52.68 72.47,52.68 71.22,51.43 JOY.5 | J3.1 44.45,36.98 v44.42,36.96
  Bottom 0.406: v44.42,36.96 50.93,36.96 55.88,41.91 64.77,41.91 67.31,44.45 67.31,51.41 JOY.5
  Bottom 0.61: U$1.18 11.1
N$10
  Top 0.406: M2.LCK 55.88,35.67 55.88,36.3 53.59,38.58 52.09,38.58 J2.1
  Bottom 0.61: U$1.14 11.10 61.71,29.84 M2.LCK
N$11
  Top 0.406: 1.3 73.71,73.03 73.28,73.46 72.4,73.46 *R8.2
  Bottom 0.61: U$1.RST 1.3
N$12  (via drill 0.6)
  Top 0.406: R20.2 129.9,37.36 129.93,37.39 133.24,37.39 137.31,33.32 v137.31,20.68 | v139.53,20.68 139.53,18.11 SD1.2
  Bottom 0.406: v139.53,20.68 v137.31,20.68
N$13
  Top 0.406: 1.9 72.26,57.78 68.45,53.97 JOY.4 67.27,53.95 65.15,53.95 63.84,52.64 R4.1 60.63,52.64 R5.2
  Bottom 0.61: U$1.16 1.9
N$14  (via drill 0.6)
  Top 0.406: J4.1 49.53,37.67 50.39,36.8 53.75,36.8 54.81,35.74 54.81,34.21 M2.DIN
  Top 0.61: v63.2,31.5 62.52,30.82 M2.DIN
  Bottom 0.61: U$1.13 11.9 65.61,32.38 64.72,31.5 v63.2,31.5
N$15  (via drill 0.6)
  Top 0.406: 58.17,28.27 M2.BCK 53.44,33.03 53.44,35 52.88,35.56 49.05,35.56 47.02,37.59 47.02,38.58 J5.1
  Top 0.61: v64.64,33.4 64.64,29.92 62.99,28.27 58.2,28.27 M2.BCK
  Bottom 0.61: U$1.12 11.8 75.49,34.85 66.09,34.85 v64.64,33.4
N$16
  Bottom 0.61: U$1.7 1.7
N$17
  Bottom 0.61: U$1.2 SV7.6
N$18
  Top 0.406: 1.8 75.46,60.22 arc90 75.36,60.33 73.08,60.33 69.49,63.91 35.31,63.91 33.81,65.41 33.81,66.04 | 33.81,66.04 33.81,74.99 IR.1 | R14.1 33.77,66 33.81,66.04
  Bottom 0.61: U$1.15 1.8
N$19
  Top 0.406: D2.C R8.2
N$20
  Bottom 0.61: U$1.44 SV7.8
N$21
  Bottom 0.61: U$1.43 SV7.9
N$22
  Bottom 0.61: U$1.19 SV4.3
N$23
  Bottom 0.61: U$1.20 SV4.4
N$24
  Bottom 0.61: U$1.0 SV4.9
N$25
  Bottom 0.61: U$1.35 SV4.10
N$26
  Bottom 0.61: U$1.36 SV4.11
N$27
  Bottom 0.61: U$1.37 SV4.12
N$28
  Top 0.406: R12.1 73.61,47.62 11.3
  Bottom 0.61: U$1.3 11.3
N$30
  Top 0.406: D1.C R13.2
N$31
  Top 0.61: CARD.1 119.3,45.01 117.35,45.01 115.9,43.56 J1.2
N$32
  Top 0.406: R19.2 135.33,39.93 138.43,36.83 SD1.3
N$33  (via drill 0.6)
  Top 0.406: R16.2 v131.6,42.56 | SD1.5 136.23,29.21 v131.6,33.84
  Bottom 0.406: v131.6,42.56 v131.6,33.84
N$34  (via drill 0.6)
  Top 0.254: USB-C.A6 114.36,5.82 114.66,5.52 115.15,5.52 115.34,5.75 USB-C.B6 115.34,6.81 115.37,6.84 115.37,8.15 115.53,8.32
  Top 0.305: v116.84,11.43 116.15,10.74 U1.3 115.53,8.32
  Bottom 0.406: UBS2.5 122.3,7.24 118.11,11.43 v116.84,11.43 114.3,11.43 113.03,10.16 110.49,10.16 106.07,14.58 98.06,14.58 97.26,15.38 USB.2
N$35  (via drill 0.6)
  Top 0.254: USB-C.B7 113.84,8.08 | 113.84,8.08 113.63,8.29 U1.1 | USB-C.A7 114.86,6.81 114.86,7.77 114.55,8.08 113.84,8.08
  Top 0.305: v112.17,11.89 112.17,11.35 112.78,10.74 U1.1
  Bottom 0.406: USB.1 106.27,17.78 v112.17,11.89 112.88,12.6 118.69,12.6 121.52,9.78 UBS2.4
N$36
  Top 0.406: J2.2 I2S.3
N$37  (via drill 0.6)
  Top 0.254: 115.53,13.15 U1.4
  Top 0.305: USB-C.B5 116.35,8.02 116.36,8.03 116.36,9.4 118.01,11.05 118.01,12.72 117.24,13.49 U1.4 115.53,14.34 115.77,14.58 115.91,14.58 R17.2 117.52,15.33 118.45,16.27 v119.04,16.27
  Bottom 0.406: UBS2.2 120.44,14.86 v119.04,16.27
N$38  (via drill 0.6)
  Top 0.254: USB-C.A5 113.36,7.77 112.88,8.26
  Top 0.305: 112.88,8.26 112.88,9.45 111.18,11.15 111.18,12.7 111.97,13.49 U1.6 113.63,13.93 113.23,14.33 113.23,14.59 R18.2
  Top 0.406: UBS2.3 122.19,12.32 v121.03,13.48 | v110.36,15.26 R18.2
  Bottom 0.406: v121.03,13.48 112.14,13.48 v110.36,15.26
N$39
  Top 0.406: J3.2 I2S.6
N$40
  Top 0.406: J5.2 I2S.5
N$41
  Top 0.406: J4.2 I2S.4
OLED-CLK
  Top 0.61: R1.1 SV7.1
  Bottom 0.61: U$1.38 SV7.1
OLED-CS
  Top 0.61: OLED.1 SV7.5
  Bottom 0.61: U$1.42 SV7.5
OLED-DC
  Top 0.61: R3.1 SV7.3
  Bottom 0.61: U$1.40 SV7.3
OLED-MOSI
  Top 0.61: R2.1 SV7.2
  Bottom 0.61: U$1.39 SV7.2
OLED-RESET
  Top 0.61: SV7.4 OLED.2
  Bottom 0.61: U$1.41 SV7.4
SW1  (via drill 0.6 pad 0.81)
  Top 0.406: 1.4 73.86,70.48 71.12,67.74 60.22,67.74 59.79,67.31 54.61,67.31 v53.92,68 | v43.18,68.58 43.18,70.84 44.96,72.62 44.96,74.98 EN1.3
  Bottom 0.406: U$1.4 1.4 | v43.18,68.58 52.73,68.58 53.31,68 v53.92,68
SW2
  Top 0.406: EN2.3 60.96,76.2 62.23,77.47 71.12,77.47 71.73,76.86 98.4,76.86 U$1.1
  Bottom 0.61: U$1.1 SV7.7

### Text on the board
TopPlace: 3V3 | ADC | 3V3 | IN | 3V3 | SW | A | B | 3V3 | SW | A | B | GND | SDA | GND | GND | GND | CS | RST | DC | MOSI | CLK | GND | 5V | MCLK | BCK | DATA | LCK | GND | 5V | VCC | CLK | 3.3V/ 5V | MOSI | PCM5102A module | CS | MISO | GND | L | R | ESP32 Web Radio | PCB Rev 1.0 FEB 2025, Robgold, OPEN SOURCE | https://github.com/dzikakuna | https://www.elektroda.pl/rtvforum/topic4041603.html | 175mm extentsion for 3D printed housing
tDocu: EXTENSION 175mm